# Altium schematic sheet Power.SchDoc
size A4
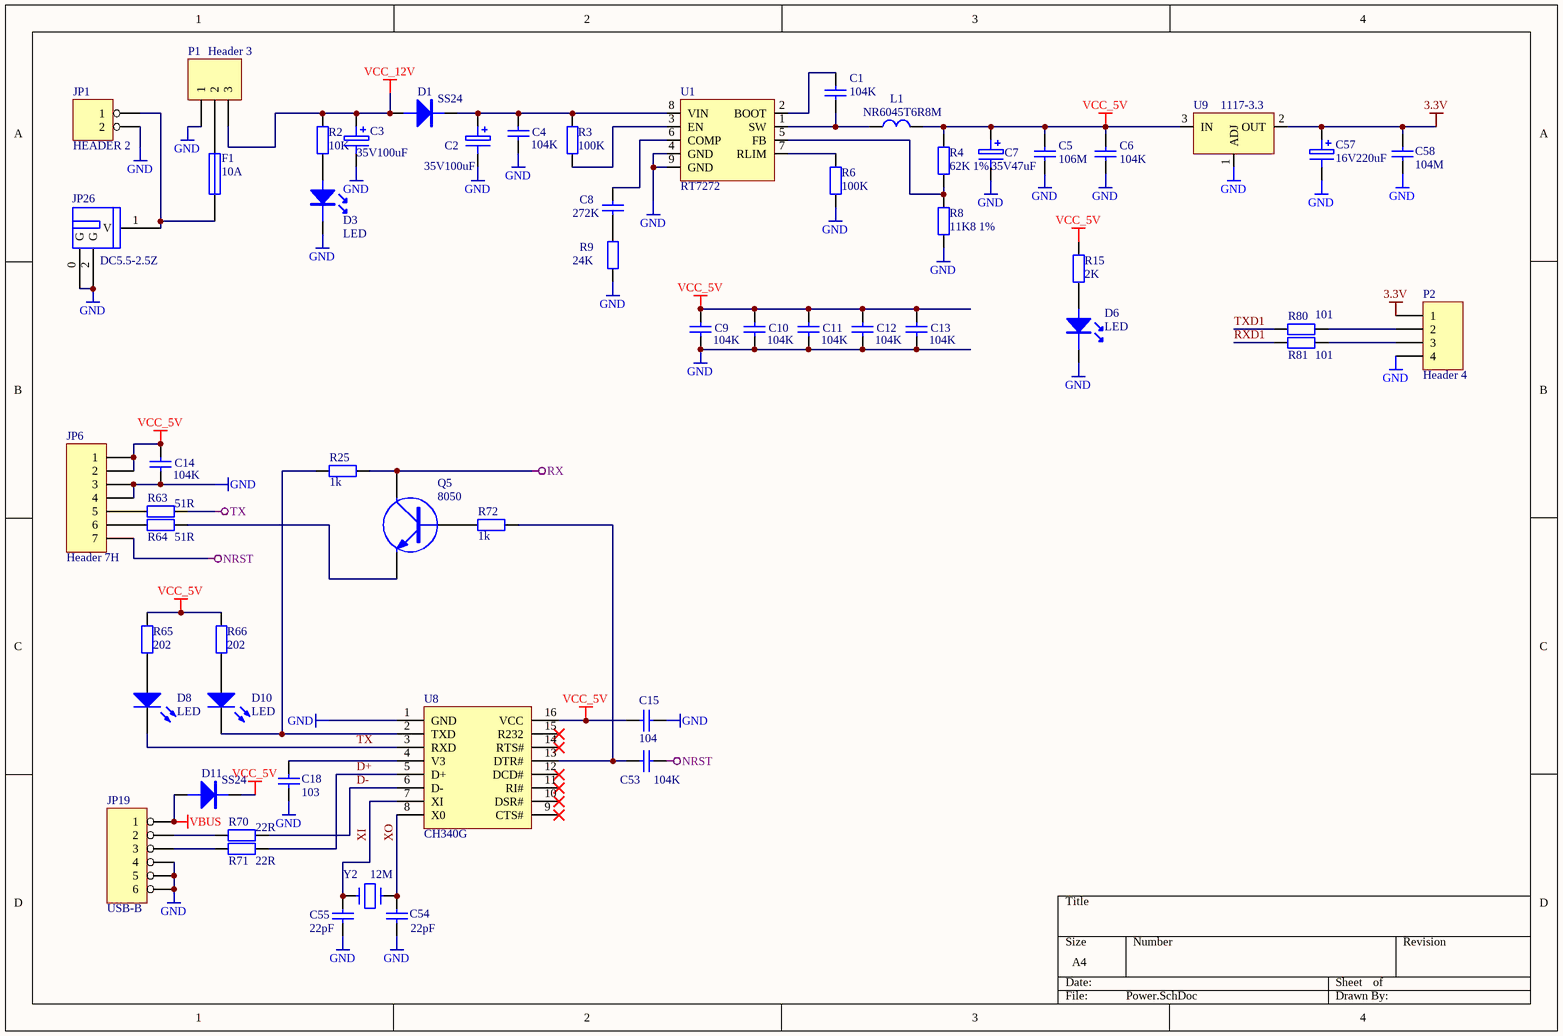
[diagram p0: Power.SchDoc]

## Parts
C1  104K  [0805(CS)]
C2  35V100uF  [F6]
C3  35V100uF  [F6]
C4  104K  [0805(C)]
C5  106M  [0603(C)]
C6  104K  [0805(CS)]
C7  35V47uF  [F6]
C8  272K  [0603(C)]
C9  104K  [0805(CS)]
C10  104K  [0805(CS)]
C11  104K  [0805(CS)]
C12  104K  [0805(CS)]
C13  104K  [0805(CS)]
C14  104K  [0805(CS)]
C15  104  [0805(CS)]
C18  103  [0603(C)]
C53  104K  [0805(CS)]
C54  22pF  [0603(C)]
C55  22pF  [0603(C)]
C57  16V220uF  [F6]
C58  104M  [0603(C)]
D1  SS24  [SMA]
D3  LED  [LED-SMD-0805]
D6  LED  [LED-SMD-0805]
D8  LED  [LED-SMD-0805]
D10  LED  [LED-SMD-0805]
D11  SS24  [SMA]
F1  10A  [1206(F)]
JP1  HEADER 2  [POWER JACK-2*5.0]
JP6  Header 7H  [XH2.54-7P]
JP19  USB-B  [USBBW]
JP26  DC5.5-2.5Z  [DC-528]
L1  NR6045T6R8M  [COKE_6X6]
P1  Header 3  [POWER JACK-3*5.0]
P2  Header 4  [HDR1X4]
Q5  8050  [SOT23]
R2  10K  [0603(R)]
R3  100K  [0603(R)]
R4  62K 1%  [0603(R)]
R6  100K  [0603(R)]
R8  11K8 1%  [0603(R)]
R9  24K  [0603(R)]
R15  2K  [0603(R)]
R25  1k  [0603(R)]
R63  51R  [0603(R)]
R64  51R  [0603(R)]
R65  202  [0603(R)]
R66  202  [0603(R)]
R70  22R  [0603(R)]
R71  22R  [0603(R)]
R72  1k  [0603(R)]
R80  101  [0603(R)]
R81  101  [0603(R)]
U1  RT7272  [SO8-EP]
U8  CH340G  [SO-16]
U9  1117-3.3  [SOT223-1117]
Y2  12M  [CRYS-SMD-5032-2P]

## Nets
3.3V: C57.1 C58.2 P2.1 U9.2(OUT)
GND: C2.2 C3.2 C4.1 C5.1 C6.1 C7.2 C9.1 C10.1 C11.1 C12.1 C13.1 C14.1 C15.1 C18.1 C54.2 C55.2 C57.2 C58.1 D3.2 D6.2 JP1.2 JP6.3 JP6.4 JP19.4 JP19.5 JP19.6 JP26.0(G) JP26.2(G) P1.1 P2.4 R6.2 R8.2 R9.2 U1.4(GND) U1.9(GND) U8.1(GND) U9.1(ADJ)
NRST: C53.2 JP6.7
RX: Q5.3(C) R25.1
TX: D8.2(K) R63.2 U8.3(RXD)
VBUS: D11.1 JP19.1
VCC_5V: C5.2 C6.2 C7.1 C9.2 C10.2 C11.2 C12.2 C13.2 C14.2 C15.2 D11.2 JP6.1 JP6.2 L1.2 R4.1 R15.1 R65.2 R66.2 U8.16(VCC) U9.3(IN)
VCC_12V: C3.1 D1.1 P1.3 R2.1
D+: R71.2 U8.5(D+)
D-: R70.2 U8.6(D-)
RXD1: R81.1
TXD1: R80.1
XI: C55.1 U8.7(XI) Y2.1
XO: C54.1 U8.8(X0) Y2.2
NetC1_1: C1.1 L1.1 U1.1(SW)
NetC1_2: C1.2 U1.2(BOOT)
NetC2_1: C2.1 C4.2 D1.2 R3.1 U1.8(VIN)
NetC8_1: C8.1 R9.1
NetC8_2: C8.2 U1.6(COMP)
NetC18_2: C18.2 U8.4(V3)
NetC53_1: C53.1 R72.1 U8.13(DTR#)
NetD3_1: D3.1 R2.2
NetD6_1: D6.1 R15.2
NetD8_1: D8.1(A) R65.1
NetD10_1: D10.1(A) R66.1
NetD10_2: D10.2(K) R25.2 U8.2(TXD)
NetF1_1: F1.1 P1.2
NetF1_2: F1.2 JP1.1 JP26.1(V)
NetJP6_5: JP6.5 R63.1
NetJP6_6: JP6.6 R64.1
NetJP19_2: JP19.2 R70.1
NetJP19_3: JP19.3 R71.1
NetP2_2: P2.2 R80.2
NetP2_3: P2.3 R81.2
NetQ5_1: Q5.1(B) R72.2
NetQ5_2: Q5.2(E) R64.2
NetR3_2: R3.2 U1.3(EN)
NetR4_2: R4.2 R8.1 U1.5(FB)
NetR6_1: R6.1 U1.7(RLIM)

Not connected (* = marked no-connect by the designer): U8 9(CTS#)* 10(DSR#)* 11(RI#)* 12(DCD#)* 14(RTS#)* 15(R232)*

## Library data of the parts
C1 C4-C6 C8-C14 C58 = Cap: Capacitor; Value: 104; Published: 8-Jun-2000; LatestRevisionDate: 17-Jul-2002; LatestRevisionNote: Re-released for DXP Platform.; PackageReference: RAD-0.3; Publisher: Altium Limited; PackageDescription: Radial Cap, Thru-Hole; 2 Leads; 0.3 in Pin Spacing
C2 C3 C7 C57 = ELECTRO1: Electrolytic Capacitor
C15 C18 = CAP: Capacitor; Value: 0.1UF; Published: 8-Jun-2000; LatestRevisionDate: 17-Jul-2002; LatestRevisionNote: Re-released for DXP Platform.; PackageReference: RAD-0.3; Publisher: Altium Limited
C53-C55 = Cap: Capacitor; Value: 30pF; Published: 8-Jun-2000; LatestRevisionDate: 17-Jul-2002; LatestRevisionNote: Re-released for DXP Platform.; PackageReference: RAD-0.3; Publisher: Altium Limited; PackageDescription: Radial Cap, Thru-Hole; 2 Leads; 0.3 in Pin Spacing
D1 D11 = DIODE
D8 D10 = LED1: Typical RED GaAs LED; Published: 8-Jun-2000; LatestRevisionDate: 08-Jul-2005; LatestRevisionNote: Mech Layer 1 removed.; PackageReference: LED-1; Publisher: Altium Limited; PackageDescription: LED; 2 Leads
F1 = FUSE1: Fuse
JP6 = Header 7H: Header, 7-Pin, Right Angle; LatestRevisionDate: 17-Jul-2002; LatestRevisionNote: Re-released for DXP Platform.; Publisher: Altium Limited
JP19 = HEADER 6
L1 = INDUCTOR
P1 = Header 3: Header, 3-Pin; LatestRevisionDate: 17-Jul-2002; LatestRevisionNote: Re-released for DXP Platform.; Publisher: Altium Limited
P2 = Header 4: Header, 4-Pin; LatestRevisionDate: 17-Jul-2002; LatestRevisionNote: Re-released for DXP Platform.; Publisher: Altium Limited
Q5 = NPN: NPN Transistor
R2-R4 R6 R8 R9 R15 R25 R63-R66 R70-R72 R80 R81 = Res2: Resistor; Value: 1K5; Published: 8-Jun-2000; LatestRevisionDate: 17-Jul-2002; LatestRevisionNote: Re-released for DXP Platform.; PackageReference: AXIAL-0.4; Publisher: Altium Limited; PackageDescription: Axial Device, Thru-Hole; 2 Leads; 0.4 in Pin Spacing
U9 = 1117
Y2 = CRYSTAL